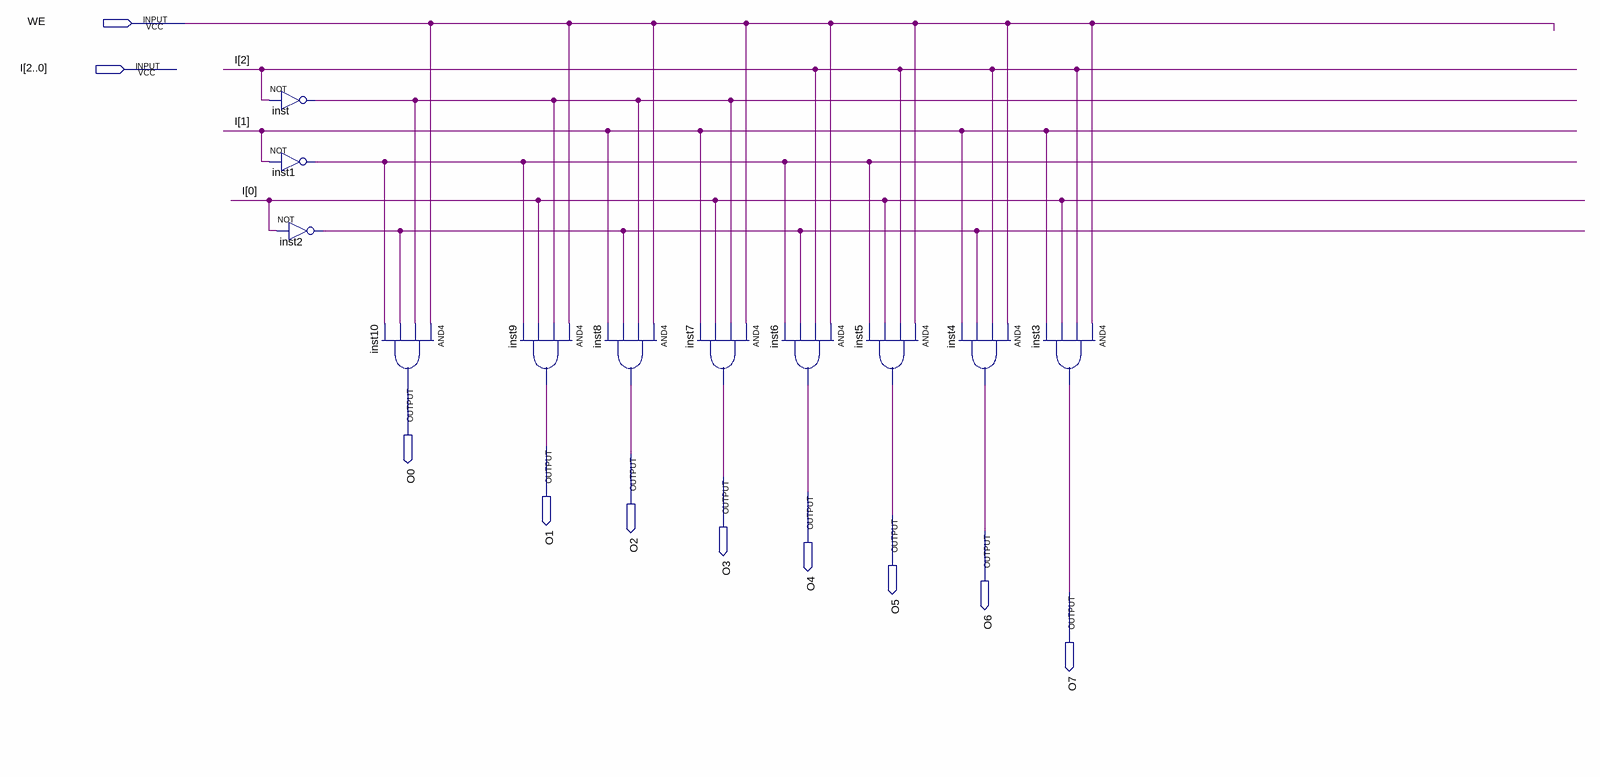
[diagram p0: schematic sheet]
// Quartus schematic DECODER3TO8.bdf as structural Verilog: 11 symbols, 10 pins
module DECODER3TO8 (
  input  WE,
  input  [2:0] I,
  output O0,
  output O1,
  output O2,
  output O3,
  output O4,
  output O5,
  output O6,
  output O7
);

  wire inst1_out, inst2_out, inst_out;

  not inst (inst_out, I[2]);
  not inst1 (inst1_out, I[1]);
  not inst2 (inst2_out, I[0]);
  and inst10 (O0, WE, inst_out, inst2_out, inst1_out);
  and inst9 (O1, WE, inst_out, I[0], inst1_out);
  and inst8 (O2, WE, inst_out, inst2_out, I[1]);
  and inst7 (O3, WE, inst_out, I[0], I[1]);
  and inst6 (O4, WE, I[2], inst2_out, inst1_out);
  and inst5 (O5, WE, I[2], I[0], inst1_out);
  and inst4 (O6, WE, I[2], inst2_out, I[1]);
  and inst3 (O7, WE, I[2], I[0], I[1]);
endmodule
